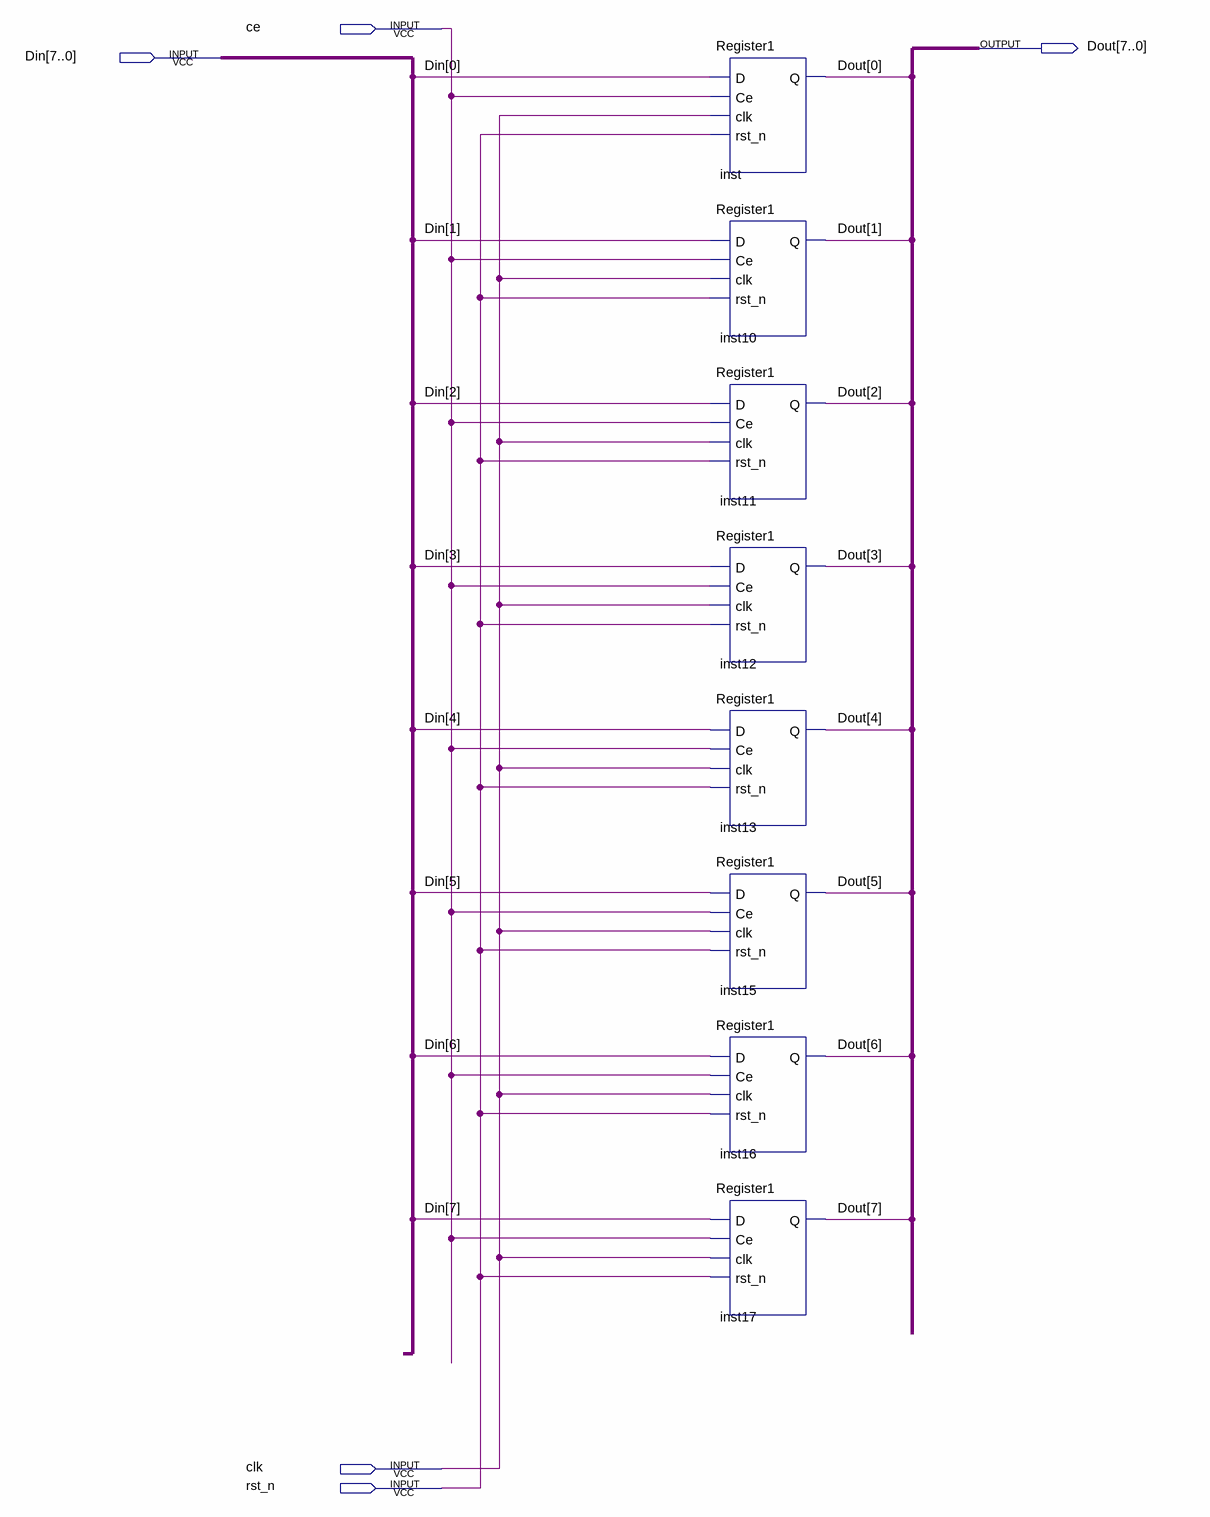
[diagram p0: schematic sheet]
// Quartus schematic Register8.bdf as structural Verilog: 8 symbols, 5 pins
module Register8 (
  input  ce,
  input  [7:0] Din,
  input  clk,
  input  rst_n,
  output [7:0] Dout
);

  Register1 inst (.D(Din[0]), .Ce(ce), .clk(clk), .rst_n(rst_n), .Q(Dout[0]));
  Register1 inst10 (.D(Din[1]), .Ce(ce), .clk(clk), .rst_n(rst_n), .Q(Dout[1]));
  Register1 inst11 (.D(Din[2]), .Ce(ce), .clk(clk), .rst_n(rst_n), .Q(Dout[2]));
  Register1 inst12 (.D(Din[3]), .Ce(ce), .clk(clk), .rst_n(rst_n), .Q(Dout[3]));
  Register1 inst13 (.D(Din[4]), .Ce(ce), .clk(clk), .rst_n(rst_n), .Q(Dout[4]));
  Register1 inst15 (.D(Din[5]), .Ce(ce), .clk(clk), .rst_n(rst_n), .Q(Dout[5]));
  Register1 inst16 (.D(Din[6]), .Ce(ce), .clk(clk), .rst_n(rst_n), .Q(Dout[6]));
  Register1 inst17 (.D(Din[7]), .Ce(ce), .clk(clk), .rst_n(rst_n), .Q(Dout[7]));
endmodule
